# Altium schematic sheet 头部位置编码器-V4.1.SchDoc
size A4
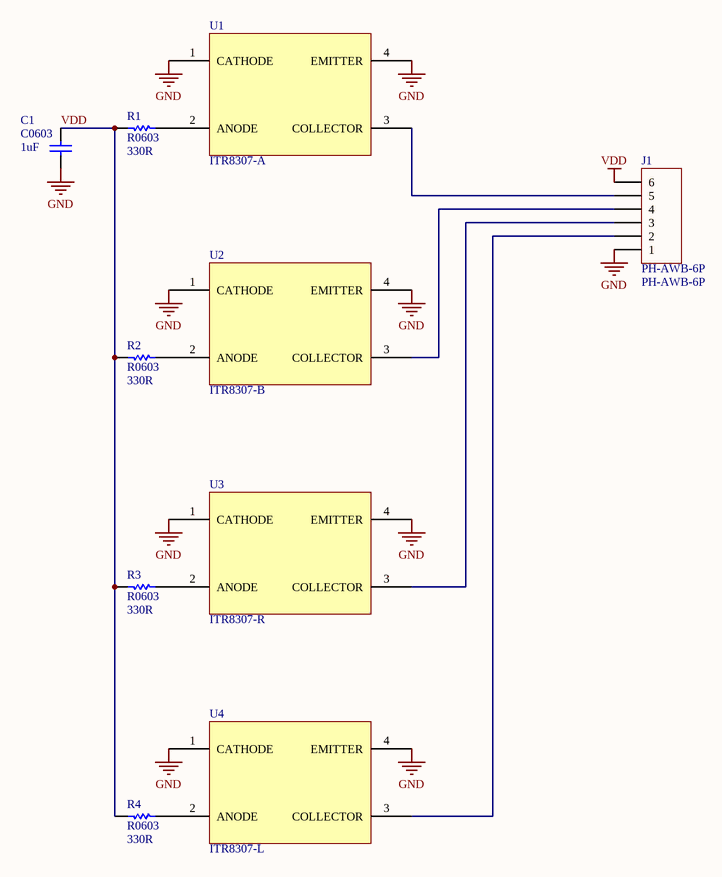
[diagram p0: 头部位置编码器-V4.1.SchDoc]

## Parts
C1  C0603  value 1uF  [C0603_M1608]
J1  PH-AWB-6P  [PH-AWB-6P]
R1  R0603  value 330R  [R0603_M1608]
R2  R0603  value 330R  [R0603_M1608]
R3  R0603  value 330R  [R0603_M1608]
R4  R0603  value 330R  [R0603_M1608]
U1  ITR8307-A  [ITR8307]
U2  ITR8307-B  [ITR8307]
U3  ITR8307-R  [ITR8307]
U4  ITR8307-L  [ITR8307]

## Nets
GND: C1.2 J1.1 U1.1(CATHODE) U1.4(EMITTER) U2.1(CATHODE) U2.4(EMITTER) U3.1(CATHODE) U3.4(EMITTER) U4.1(CATHODE) U4.4(EMITTER)
VDD: C1.1 J1.6 R1.2 R2.2 R3.2 R4.2
NetJ1_2: J1.2 U4.3(COLLECTOR)
NetJ1_3: J1.3 U3.3(COLLECTOR)
NetJ1_4: J1.4 U2.3(COLLECTOR)
NetJ1_5: J1.5 U1.3(COLLECTOR)
NetR1_1: R1.1 U1.2(ANODE)
NetR2_1: R2.1 U2.2(ANODE)
NetR3_1: R3.1 U3.2(ANODE)
NetR4_1: R4.1 U4.2(ANODE)

## Library data of the parts
C1 = Cap: Capacitor; Published: 8-Jun-2000; LatestRevisionDate: 17-Jul-2002; LatestRevisionNote: Re-released for DXP Platform.; PackageReference: RAD-0.3; Publisher: Altium Limited; PackageDescription: Radial Cap, Thru-Hole; 2 Leads; 0.3 in Pin Spacing
J1 = PH2.0-6P: Header, 6-Pin; LatestRevisionDate: 17-Jul-2002; LatestRevisionNote: Re-released for DXP Platform.; Publisher: Altium Limited; Value: PH-AWB-6P
R1-R4 = Res1: Resistor; Published: 8-Jun-2000; LatestRevisionDate: 17-Jul-2002; LatestRevisionNote: Re-released for DXP Platform.; PackageReference: AXIAL-0.3; Publisher: Altium Limited
U1-U4 = Component_1